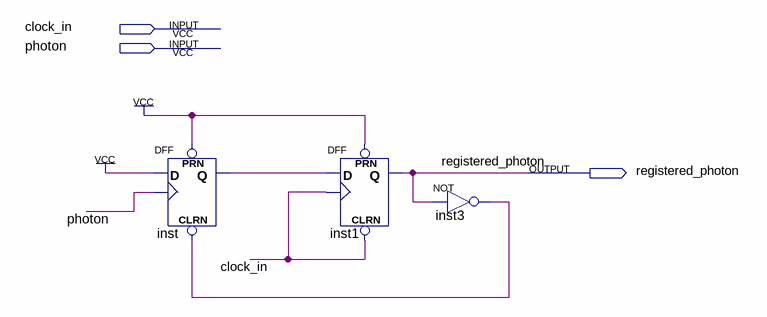
[diagram p0: schematic sheet]
// Quartus schematic registerPhotonsFullWidth.bdf as structural Verilog: 3 symbols, 3 pins
module registerPhotonsFullWidth (
  input  clock_in,
  input  photon,
  output registered_photon
);

  wire inst3_out, inst_q;

  DFF inst (.CLRN(inst3_out), .CLK(photon), .D(1'b1), .PRN(1'b1), .Q(inst_q));
  DFF inst1 (.CLRN(clock_in), .CLK(clock_in), .D(inst_q), .PRN(1'b1), .Q(registered_photon));
  not inst3 (inst3_out, registered_photon);
endmodule
